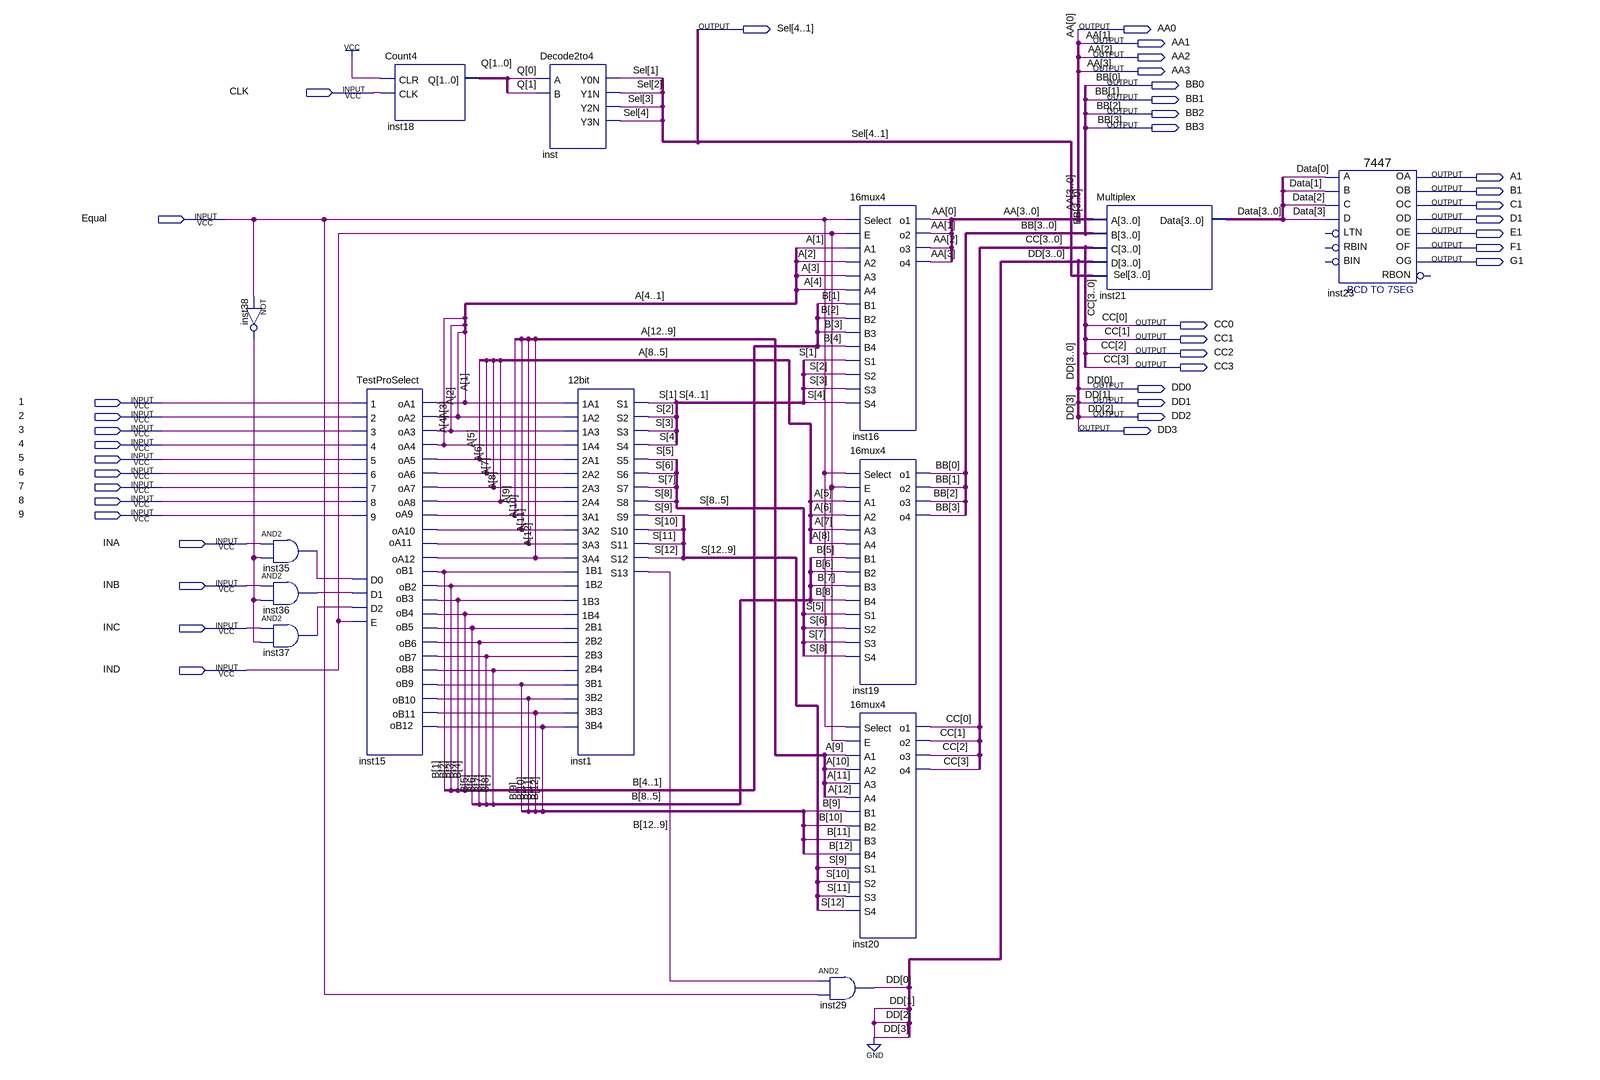
[diagram p0: schematic sheet]
// Quartus schematic miniProjectAdder.bdf as structural Verilog: 14 symbols, 39 pins
module miniProjectAdder (
  input  CLK,
  input  Equal,
  input  \1 ,
  input  \2 ,
  input  \3 ,
  input  \4 ,
  input  \5 ,
  input  \6 ,
  input  \7 ,
  input  \8 ,
  input  \9 ,
  input  INA,
  input  INB,
  input  INC,
  input  IND,
  output [4:1] Sel,
  output AA0,
  output AA1,
  output AA2,
  output AA3,
  output BB0,
  output BB1,
  output BB2,
  output BB3,
  output A1,
  output B1,
  output C1,
  output D1,
  output E1,
  output F1,
  output G1,
  output CC0,
  output CC1,
  output CC2,
  output CC3,
  output DD0,
  output DD1,
  output DD2,
  output DD3
);

  wire inst1_s13, inst35_out, inst36_out, inst37_out, inst38_out;
  wire [1:0] Q;
  wire [3:0] Data;
  wire [12:1] S;
  wire [12:2] A, B;

  not inst38 (inst38_out, Equal);
  and inst35 (inst35_out, INA, inst38_out);
  and inst36 (inst36_out, INB, inst38_out);
  and inst37 (inst37_out, INC, inst38_out);
  TestProSelect inst15 (
    .\1 (\1 ), .\2 (\2 ), .\3 (\3 ), .\4 (\4 ), .\5 (\5 ), .\6 (\6 ), .\7 (\7 ), .\8 (\8 ), .\9 (\9 ),
    .E(IND), .D0(inst35_out), .D1(inst36_out), .D2(inst37_out), .oA1(A1), .oA2(A[2]), .oA3(A[3]), .oA4(A[4]),
    .oA5(A[5]), .oA6(A[6]), .oA7(A[7]), .oA8(A[8]), .oA9(A[9]), .oA10(A[10]), .oA11(A[11]), .oA12(A[12]),
    .oB1(B1), .oB2(B[2]), .oB3(B[3]), .oB4(B[4]), .oB5(B[5]), .oB6(B[6]), .oB7(B[7]), .oB8(B[8]), .oB9(B[9]),
    .oB10(B[10]), .oB11(B[11]), .oB12(B[12]));
  Count4 inst18 (.CLR(1'b1), .CLK(CLK), .Q(Q));
  Decode2to4 inst (.A(Q[0]), .B(Q[1]), .Y0N(Sel[1]), .Y1N(Sel[2]), .Y2N(Sel[3]), .Y3N(Sel[4]));
  \12bit  inst1 (
    .\1B1 (B1), .\1B2 (B[2]), .\1B3 (B[3]), .\1B4 (B[4]), .\1A1 (A1), .\1A2 (A[2]), .\1A3 (A[3]),
    .\1A4 (A[4]), .\2B1 (B[5]), .\2B2 (B[6]), .\2B3 (B[7]), .\2B4 (B[8]), .\2A1 (A[5]), .\2A2 (A[6]),
    .\2A3 (A[7]), .\2A4 (A[8]), .\3B1 (B[9]), .\3B2 (B[10]), .\3B3 (B[11]), .\3B4 (B[12]), .\3A1 (A[9]),
    .\3A2 (A[10]), .\3A3 (A[11]), .\3A4 (A[12]), .S1(S[1]), .S2(S[2]), .S3(S[3]), .S4(S[4]), .S5(S[5]),
    .S6(S[6]), .S7(S[7]), .S8(S[8]), .S9(S[9]), .S10(S[10]), .S11(S[11]), .S12(S[12]), .S13(inst1_s13));
  and inst29 (DD0, inst1_s13, Equal);
  \16mux4  inst16 (
    .Select(Equal), .E(IND), .A1(A1), .A2(A[2]), .A3(A[3]), .A4(A[4]), .B1(B1), .B2(B[2]), .B3(B[3]),
    .B4(B[4]), .S1(S[1]), .S2(S[2]), .S3(S[3]), .S4(S[4]), .o1(AA0), .o2(AA1), .o3(AA2), .o4(AA3));
  \16mux4  inst19 (
    .Select(Equal), .E(IND), .A1(A[5]), .A2(A[6]), .A3(A[7]), .A4(A[8]), .B1(B[5]), .B2(B[6]), .B3(B[7]),
    .B4(B[8]), .S1(S[5]), .S2(S[6]), .S3(S[7]), .S4(S[8]), .o1(BB0), .o2(BB1), .o3(BB2), .o4(BB3));
  \16mux4  inst20 (
    .Select(Equal), .E(IND), .A1(A[9]), .A2(A[10]), .A3(A[11]), .A4(A[12]), .B1(B[9]), .B2(B[10]),
    .B3(B[11]), .B4(B[12]), .S1(S[9]), .S2(S[10]), .S3(S[11]), .S4(S[12]), .o1(CC0), .o2(CC1), .o3(CC2),
    .o4(CC3));
  Multiplex inst21 (
    .A({AA3, AA2, AA1, AA0}), .Sel(Sel), .B({BB3, BB2, BB1, BB0}), .C({CC3, CC2, CC1, CC0}),
    .D({3'b000, DD0}), .Data(Data));
  \7447  inst23 (
    .B(Data[1]), .C(Data[2]), .D(Data[3]), .A(Data[0]), .OB(B1), .OC(C1), .OE(E1), .OD(D1), .OF(F1), .OG(G1),
    .OA(A1));  // open: LTN, RBIN, BIN, RBON

  assign DD1 = 1'b0;
  assign DD2 = 1'b0;
  assign DD3 = 1'b0;
endmodule
